# EAGLE design ASM2021 (EAGLE 9.6.2)
DATABASE: ./../../../../../Components/TinyCircuits_Part_Database.txt
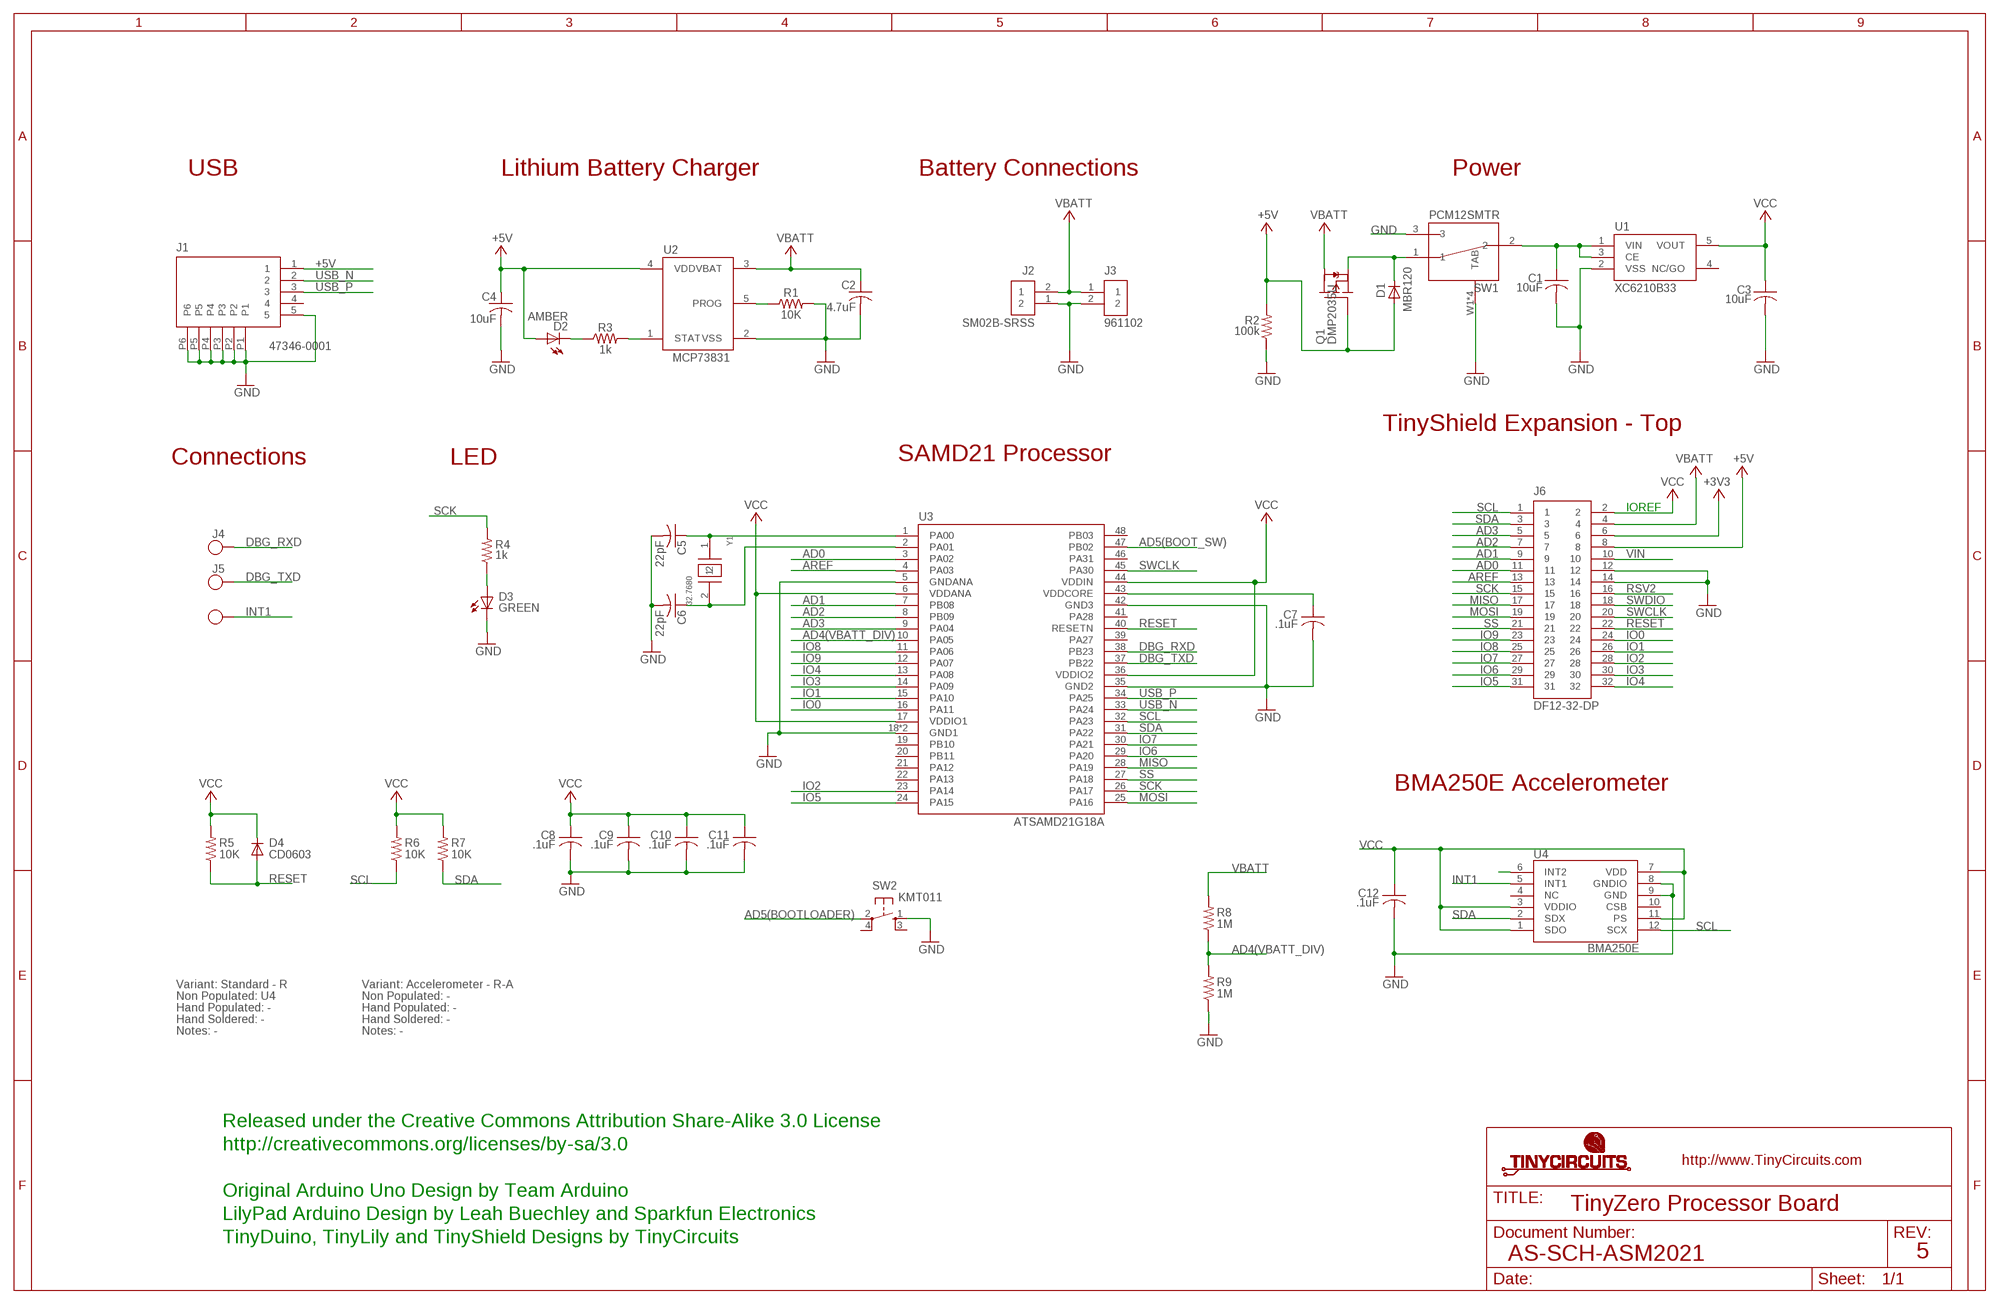
[diagram p0: schematic, sheet 1]

## Parts
C1  10uF  AS-ITM-00002  [C0603]
C2  4.7uF  AS-ITM-00088  [C0603]
C3  10uF  AS-ITM-00002  [C0603]
C4  10uF  AS-ITM-00002  [C0603]
C5  22pF  AS-ITM-00211  [C0402]
C6  22pF  AS-ITM-00211  [C0402]
C7  .1uF  AS-ITM-00008  [C0402]
C8  .1uF  AS-ITM-00008  [C0402]
C9  .1uF  AS-ITM-00008  [C0402]
C10  .1uF  AS-ITM-00008  [C0402]
C11  .1uF  AS-ITM-00008  [C0402]
C12  .1uF  AS-ITM-00008  [C0402]
D1  MBR120  AS-ITM-00111  [SOD-123FL]
D2  AMBER  AS-ITM-00026  [LNJ_LED]
D3  GREEN  AS-ITM-00011  [LNJ_LED]
D4  CD0603  AS-ITM-00009  [0603]
J1  47346-0001  AS-ITM-00021  [MICRO_USB]
J2  SM02B-SRSS  AS-ITM-00231  [JST_SH_2X1]
J3  961102  AS-ITM-00044  [2X.1"]
J4  TEST_POINT  [TEST_POINT_1MM]
J5  TEST_POINT  [TEST_POINT_1MM]
J6  DF12-32-DP  AS-ITM-00015  [DF12-32-DP]
Q1  DMP2035U  AS-ITM-00024  [SOT23]
R1  10K  AS-ITM-00032  [0402]
R2  100k  AS-ITM-00004  [0402]
R3  1k  AS-ITM-00003  [0402]
R4  1k  AS-ITM-00003  [0402]
R5  10K  AS-ITM-00032  [0402]
R6  10K  AS-ITM-00032  [0402]
R7  10K  AS-ITM-00032  [0402]
R8  1M  AS-ITM-00005  [0402]
R9  1M  AS-ITM-00005  [0402]
SW1  PCM12SMTR  AS-ITM-00220  [PCM12SMTR]
SW2  KMT011  AS-ITM-00041  [KMT011]
U1  XC6210B33  AS-ITM-00046  [SOT-25]
U2  MCP73831  AS-ITM-00136  [SOT-23]
U3  ATSAMD21G18A  AS-ITM-00273  [QFN48]
U4  BMA250E  AS-ITM-00070  [3-AXIS_ACCELEROMETER]
Y1  32.7680  AS-ITM-00279  [ABS06]

## Nets
+3V3: J6.6
+5V: C4.1 D1.A D2.A J1.1 J6.8 Q1.B(G) R2.2 U2.4(VDD)
AD0: J6.11 U3.3(PA02)
AD1: J6.9 U3.7(PB08)
AD2: J6.7 U3.8(PB09)
AD3: J6.5 U3.9(PA04)
AD4(VBATT_DIV): R8.1 R9.2 U3.10(PA05)
AD5(BOOT_SW): U3.47(PB02)
AD5(BOOTLOADER): SW2.2
AREF: J6.13 U3.4(PA03)
DBG_RXD: J4.P$1 U3.38(PB23)
DBG_TXD: J5.P$1 U3.37(PB22)
GND: C1.2 C2.2 C3.2 C4.2 C5.2 C6.2 C7.2 C8.2 C9.2 C10.2 C11.2 C12.2 D3.C J1.5 J1.P1 J1.P2 J1.P3 J1.P4 J1.P5 J1.P6 J2.1 J3.2 J6.12 J6.14 R1.2 R2.1 R9.1 SW1.3 SW1.W1(TAB) SW1.W2(TAB) SW1.W3(TAB) SW1.W4(TAB) SW2.1 U1.2(VSS) U2.2(VSS) U3.5(GNDANA) U3.18(GND1) U3.35(GND2) U3.42(GND3) U3.EXP(GND1) U4.8(GNDIO) U4.9(GND)
INT1: U4.5(INT1)
IO0: J6.24 U3.16(PA11)
IO1: J6.26 U3.15(PA10)
IO2: J6.28 U3.23(PA14)
IO3: J6.30 U3.14(PA09)
IO4: J6.32 U3.13(PA08)
IO5: J6.31 U3.24(PA15)
IO6: J6.29 U3.29(PA20)
IO7: J6.27 U3.30(PA21)
IO8: J6.25 U3.11(PA06)
IO9: J6.23 U3.12(PA07)
MISO: J6.17 U3.28(PA19)
MOSI: J6.19 U3.25(PA16)
N$1: C5.1 U3.1(PA00) Y1.1
N$2: D1.C Q1.E(S) SW1.1
N$3: C6.1 U3.2(PA01) Y1.2
N$4: D3.A R4.1
N$5: D2.C R3.1
N$6: R1.1 U2.5(PROG)
N$7: R3.2 U2.1(STAT)
N$8: C7.1 U3.43(VDDCORE)
N$13: U4.6(INT2)
RESET: D4.A J6.22 R5.1 U3.40(RESETN)
RSV2: J6.16
SCK: J6.15 R4.2 U3.26(PA17)
SCL: J6.1 R6.1 U3.32(PA23) U4.12(SCX)
SDA: J6.3 R7.1 U3.31(PA22) U4.2(SDX)
SS: J6.21 U3.27(PA18)
SWCLK: J6.20 U3.45(PA30)
SWDIO: J6.18
USB_N: J1.2 U3.33(PA24)
USB_P: J1.3 U3.34(PA25)
VBATT: C2.1 J2.2 J3.1 J6.4 Q1.C(D) R8.2 U2.3(VBAT)
VCC: C3.1 C8.1 C9.1 C10.1 C11.1 C12.1 D4.C J6.2 R5.2 R6.2 R7.2 U1.5(VOUT) U3.6(VDDANA) U3.17(VDDIO1) U3.36(VDDIO2) U3.44(VDDIN) U4.1(SDO) U4.3(VDDIO) U4.7(VDD) U4.11(PS)
VCC_IN: C1.1 SW1.2 U1.1(VIN) U1.3(CE)
VIN: J6.10
Unconnected: J1.4 SW2.3 SW2.4 U1.4(NC/GO) U3.19(PB10) U3.20(PB11) U3.21(PA12) U3.22(PA13) U3.39(PA27) U3.41(PA28) U3.46(PA31) U3.48(PB03) U4.4(NC) U4.10(CSB)

## Notes on the sheet
- USB | Lithium Battery Charger | Battery Connections | Power
- TinyShield Expansion - Top
- Connections | LED | SAMD21 Processor
- IOREF
- BMA250E Accelerometer
- Variant: Standard - R | Variant: Accelerometer - R-A
- Non Populated: U4 | Non Populated: -
- Hand Populated: - | Hand Populated: -
- Hand Soldered: - | Hand Soldered: -
- Notes: - | Notes: -
- Released under the Creative Commons Attribution Share-Alike 3.0 License
- http://creativecommons.org/licenses/by-sa/3.0
- Original Arduino Uno Design by Team Arduino
- TinyZero Processor Board
- LilyPad Arduino Design by Leah Buechley and Sparkfun Electronics
- TinyDuino, TinyLily and TinyShield Designs by TinyCircuits
- AS-SCH-ASM2021 | 5

## Library data of the parts
C1 C3 C4 = tinycircuits:AS-ITM-00002: CAP CER 10UF 10V 20% X5R 0603; PARTNO: AS-ITM-00002
C2 = tinycircuits:AS-ITM-00088: CAP CER 4.7UF 6.3V 20% X5R 0603; PARTNO: AS-ITM-00088
C5 C6 = tinycircuits:AS-ITM-00211: CAP CER 22PF 50V 2% NP0 0402; PARTNO: AS-ITM-00211
C7-C12 = tinycircuits:AS-ITM-00008: CAP CER 0.1UF 16V 10% X5R 0402; PARTNO: AS-ITM-00008; VALUE: 0.1uF
D1 = tinycircuits:AS-ITM-00111: DIODE SCHOTTKY 20V 1A SOD123L; PARTNO: AS-ITM-00111; PNPROTATION: 0; VALUE: MBR120VLSFT1G
D2 = tinycircuits:AS-ITM-00026: LED AMBER SIDE VIEW SMD; PARTNO: AS-ITM-00026; PNPROTATION: 90
D3 = tinycircuits:AS-ITM-00011: LED GREEN SIDE VIEW SMD; PARTNO: AS-ITM-00011; PNPROTATION: 90
D4 = tinycircuits:AS-ITM-00009: Diodes (General Purpose, Power, Switching) IO=150mA VR=75V HIGH SPEED; PARTNO: AS-ITM-00009; PNPROTATION: 0
J1 = tinycircuits:AS-ITM-00021: CONN RCPT 5POS MICRO USB R/A; PARTNO: AS-ITM-00021; PNPROTATION: 90
J2 = tinycircuits:AS-ITM-00231: CONN HEADER SH 2POS SIDE 1MM; PARTNO: AS-ITM-00231; PNPROTATION: 180; VALUE: SM02B-SRSS-TB(LF)(SN)
J3 = tinycircuits:AS-ITM-00044: CONN HEADER R/A SGL 2POS GOLD; PARTNO: AS-ITM-00044
J4 J5 = tinycircuits:TEST_POINT: Test point, no drill
J6 = tinycircuits:AS-ITM-00015: CONN HEADER 32POS 3MM SMD 0.5MM; PARTNO: AS-ITM-00015; PNPROTATION: 0
Q1 = tinycircuits:AS-ITM-00024: P-Channel MOSFET SOT-23; PARTNO: AS-ITM-00024; PNPROTATION: 0
R1 R5-R7 = tinycircuits:AS-ITM-00032: RES 10.0K OHM 1/16W 1% 0402 SMD; PARTNO: AS-ITM-00032; VALUE: 10.0K
R2 = tinycircuits:AS-ITM-00004: RES 100K OHM 1/16W 1% 0402; PARTNO: AS-ITM-00004; VALUE: 100K
R3 R4 = tinycircuits:AS-ITM-00003: RES 1.00K OHM 1/16W 1% 0402; PARTNO: AS-ITM-00003; VALUE: 1.00K
R8 R9 = tinycircuits:AS-ITM-00005: RES 1.00M OHM 1/16W 1% 0402; PARTNO: AS-ITM-00005; VALUE: 1.00M
SW1 = tinycircuits:AS-ITM-00220: SW SLIDE SP2T 6VDC 0.3A SMT; PARTNO: AS-ITM-00220; PNPROTATION: 0
SW2 = tinycircuits:AS-ITM-00041: SWITCH TACTILE SPST-NO 0.05A 32V; PARTNO: AS-ITM-00041
U1 = tinycircuits:AS-ITM-00046: IC REG LDO 3.3V .7A SOT-25; PARTNO: AS-ITM-00046; PNPROTATION: 270
U2 = tinycircuits:AS-ITM-00136: IC CONTROLLER LI-ION 4.2V SOT23-5; PARTNO: AS-ITM-00136; PNPROTATION: 270
U3 = tinycircuits:AS-ITM-00273: IC MCU 32BIT 256KB FLASH 48QFN; PARTNO: AS-ITM-00273; PNPROTATION: 270
U4 = tinycircuits:AS-ITM-00070: 3-AXIS ACCELEROMOETER; PARTNO: AS-ITM-00070; PNPROTATION: 90; VALUE: BMA250
Y1 = tinycircuits:AS-ITM-00279: Crystal 32.7680kHz 20ppm 12.5pF; PARTNO: AS-ITM-00279

## Board
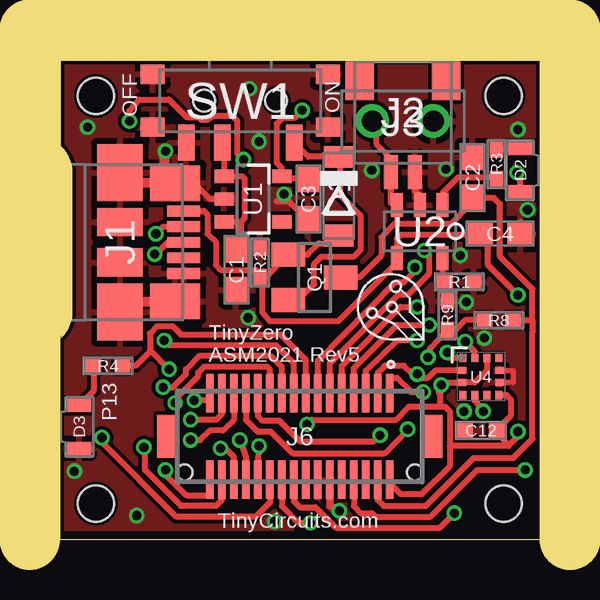
[diagram p1: board, top side]
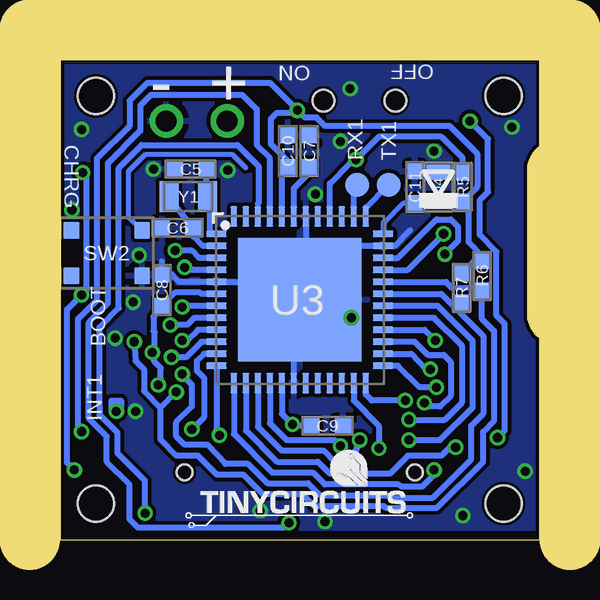
[diagram p2: board, bottom side, seen from below]

Size 20 x 20 mm. Coordinates in mm from the lower left corner, seen from the top.
Outline: 0,20 0,16.4 arc-45 0.5,15.5 0.5,9.3 arc-45 0,8.4 0,0 20,0 20,20 0,20
Copper layers (1*16): Top 0.035mm / dielectric 1.5mm / Bottom 0.035mm
Design rules "default *": minimum track width 8mil, minimum drill 15mil, track to track 6mil, track to pad 6mil, pad to pad 6mil, via to via 6mil, smd to smd 6mil, copper to edge 6mil, drill to drill 8mil, minimum pad ring 8mil, minimum via ring 5mil, stop-mask expansion 4mil, vias tented up to drill 25mil, thermal gap 10mil
Holes 1.5 mm at 1.5,18.5 18.5,18.5 1.5,1.5 18.5,1.5
tRestrict: 2 lines
bRestrict: 2 lines
Milling: 4 lines

### Footprints (pad centres in the part's own frame; a part is rotated, then mirrored left to right if it is on the bottom)
C0603 = smd 1.1 x 1: 1 -0.85,0; 2 0.85,0
C0402 = smd 0.65 x 0.6: 1 -0.65,0; 2 0.65,0
SOD-123FL = smd 0.914 x 1.219: A 1.638,0; C -1.638,0
LNJ_LED = smd 1 x 0.55: A 0,0.9; C 0,-0.9
0603 = smd 0.61 x 0.991: A 0.622,0; C -0.622,0
MICRO_USB = smd 1.38 x 0.45: 1 2.66,1.3; 2 2.66,0.65; 3 2.66,0; 4 2.66,-0.65; 5 2.66,-1.3 | smd 2.1 x 1.475: P1 2.3,-2.462; P2 2.3,2.462 | smd 1.9 x 2.375: P3 0,2.913; P4 0,-2.913 | smd 1.9 x 1.175: P5 0,0.838; P6 0,-0.838
JST_SH_2X1 = smd 0.6 x 1.4: 1 -0.5,2.475; 2 0.5,2.475 | smd 1.2 x 1.6: PAD1 -1.8,-1.325; PAD2 1.8,-1.325
2X.1" = drill 0.889 pad 1.397: 1 -1.27,0; 2 1.27,0
TEST_POINT_1MM = smd 1 x 1: P$1 0,0
DF12-32-DP = smd 0.3 x 1.6: 1 -3.75,-1.8; 2 -3.75,1.8; 3 -3.25,-1.8; 4 -3.25,1.8; 5 -2.75,-1.8; 6 -2.75,1.8; 7 -2.25,-1.8; 8 -2.25,1.8; 9 -1.75,-1.8; 10 -1.75,1.8; 11 -1.25,-1.8; 12 -1.25,1.8; 13 -0.75,-1.8; 14 -0.75,1.8; 15 -0.25,-1.8; 16 -0.25,1.8; 17 0.25,-1.8; 18 0.25,1.8; 19 0.75,-1.8; 20 0.75,1.8; 21 1.25,-1.8; 22 1.25,1.8; 23 1.75,-1.8; 24 1.75,1.8; 25 2.25,-1.8; 26 2.25,1.8; 27 2.75,-1.8; 28 2.75,1.8; 29 3.25,-1.8; 30 3.25,1.8; 31 3.75,-1.8; 32 3.75,1.8 | smd 0.9 x 1.8: F1 -5.5,0; F2 5.5,0 | hole 0.65: -4.8,1.5; 4.8,1.5
SOT23 = smd 1 x 1.4: B -0.95,-1.1; C 0,1.1; E 0.95,-1.1
0402 = smd 0.65 x 0.55: 1 -0.6,0; 2 0.6,0
PCM12SMTR = smd 0.7 x 1.5: 1 -2.25,1.75; 2 0.75,1.75; 3 2.25,1.75 | smd 1 x 0.8: W1 -3.65,1.1; W2 -3.65,-1.1; W3 3.65,-1.1; W4 3.65,1.1 | hole 0.9: 1.5,0; -1.5,0
KMT011 = smd 0.65 x 0.7: 1 -1.475,0.95; 2 -1.475,-0.95; 3 1.475,0.95; 4 1.475,-0.95
SOT-25 = smd 0.55 x 0.8: 1 -0.95,-1.2; 2 0,-1.2; 3 0.95,-1.2; 4 0.95,1.2; 5 -0.95,1.2
SOT-23 = smd 0.5 x 1: 1 -0.95,-1.1; 2 0,-1.1; 3 0.95,-1.1; 4 0.95,1.1; 5 -0.95,1.1
QFN48 = smd 0.85 x 0.28: 1 -3.475,2.75; 2 -3.475,2.25; 3 -3.475,1.75; 4 -3.475,1.25; 5 -3.475,0.75; 6 -3.475,0.25; 7 -3.475,-0.25; 8 -3.475,-0.75; 9 -3.475,-1.25; 10 -3.475,-1.75; 11 -3.475,-2.25; 12 -3.475,-2.75; 25 3.475,-2.75; 26 3.475,-2.25; 27 3.475,-1.75; 28 3.475,-1.25; 29 3.475,-0.75; 30 3.475,-0.25; 31 3.475,0.25; 32 3.475,0.75; 33 3.475,1.25; 34 3.475,1.75; 35 3.475,2.25; 36 3.475,2.75 | smd 0.28 x 0.85: 13 -2.75,-3.475; 14 -2.25,-3.475; 15 -1.75,-3.475; 16 -1.25,-3.475; 17 -0.75,-3.475; 18 -0.25,-3.475; 19 0.25,-3.475; 20 0.75,-3.475; 21 1.25,-3.475; 22 1.75,-3.475; 23 2.25,-3.475; 24 2.75,-3.475; 37 2.75,3.475; 38 2.25,3.475; 39 1.75,3.475; 40 1.25,3.475; 41 0.75,3.475; 42 0.25,3.475; 43 -0.25,3.475; 44 -0.75,3.475; 45 -1.25,3.475; 46 -1.75,3.475; 47 -2.25,3.475; 48 -2.75,3.475 | smd 5.15 x 5.15: EXP 0,0
3-AXIS_ACCELEROMETER = smd 0.3 x 0.35: 1 -0.75,0.775; 4 -0.75,-0.775; 5 -0.25,-0.775; 6 0.25,-0.775; 7 0.75,-0.775; 10 0.75,0.775; 11 0.25,0.775; 12 -0.25,0.775 | smd 0.35 x 0.3: 2 -0.775,0.25; 3 -0.775,-0.25; 8 0.775,-0.25; 9 0.775,0.25
ABS06 = smd 0.8 x 1.3: 1 -0.8,0; 2 0.8,0

### Placement (x,y rotation side)
C1  7.35,11.25 270 top
C2  17.2,15.1 90 top
C3  10.35,14.2 270 top
C4  18.35,12.75 0 top
C5  14.55,15.45 180 bottom
C6  15.1,13 180 bottom
C7  9.6,16.2 90 bottom
C8  15.75,10.4 90 bottom
C9  8.85,4.75 0 bottom
C10  10.5,16.2 90 bottom
C11  5.2,14.7 90 bottom
C12  17.55,4.55 180 top
D1  11.62,14.32 270 top
D2  19.2,15.4 180 top
D3  0.8,4.7 0 top
D4  4.22,14.7 90 bottom
J1  2.5,12.4 0 top
J2  14.3,17.8 180 top
J3  14.3,17.45 0 top
J4  7.6,14.8 0 bottom
J5  6.3,14.8 0 bottom
J6  10,4.3 180 top
Q1  10.61,10.93 270 top
R1  16.65,10.75 0 top
R2  8.34,11.55 270 top
R3  18.2,15.65 270 top
R4  2,7.25 0 top
R5  3.2,14.7 270 bottom
R6  2.4,11 90 bottom
R7  3.25,10.5 90 bottom
R8  18.3,9.15 0 top
R9  16.15,9.35 270 top
SW1  7.52,18.3 180 top
SW2  18.05,11.95 180 bottom
U1  8.05,14.2 270 top
U2  15,12.85 180 top
U3  10,10 0 bottom
U4  17.55,6.8 0 top
U$1  [DOCFIELD-TINYCIRCUITS-PCB]  34,-10 0 top  (outside the outline)
Y1  14.65,14.3 180 bottom

### Tracks (layer width: path | path; a pad name or v marks a point on that pad's centre or on a via)
+5V  (via drill 0.38)
  Top 0.254: J6.8 12.25,1.4 12.55,1.1 13,1.1 13.2,0.95 15.45,0.95 17.4,2.9 v19.4,2.9 | J1.1 6,13.7 6.15,13.55 6.15,12.75 6.5,12.4 6.5,11.45 6.7,11.25 8.15,11.25 8.3,10.92 | 8.44,10.81 8.45,10.77 8.45,9.45 8.75,9.1 11.6,9.1 14.05,11.55 U2.4 14.05,12.55 14.2,12.7 17.1,12.7 C4.1 17.85,13 17.85,11.45 v19.1,10.2 | 8.44,10.81 Q1.B 10.33,11.88 10.8,12.35 11.39,12.35 D1.A | 8.3,10.92 8.44,10.81 | R2.2 8.34,11.01 8.3,10.92 | D2.A 19.2,15.1 v19.05,15.3
  Bottom 0.254: v19.05,15.3 18.9,15.2 18.9,10.4 v19.1,10.2 19.7,9.6 19.7,3.2 v19.4,2.9
AD0  (via drill 0.38)
  Top 0.254: J6.11 11.25,7.35 14.1,10.2 14.5,10.2 15.4,11.1 15.4,11.85 v15.2,12.05
  Bottom 0.254: U3.3 14.2,11.75 14.5,12.05 v15.2,12.05
AD1  (via drill 0.38)
  Top 0.254: J6.9 11.75,7.25 14.2,9.7 v14.9,9.7
  Bottom 0.254: U3.7 14.75,9.75 v14.9,9.7
AD2  (via drill 0.38)
  Top 0.254: J6.7 12.25,7.15 14.05,8.95 v15.4,8.95
  Bottom 0.254: U3.8 14.4,9.25 14.7,8.95 v15.4,8.95
AD3  (via drill 0.38)
  Top 0.254: J6.5 12.75,7.05 14.05,8.3 v14.9,8.3
  Bottom 0.254: U3.9 14.25,8.75 14.7,8.3 v14.9,8.3
AD4(VBATT_DIV)  (via drill 0.38)
  Top 0.254: v15.35,7.6 15.45,8 R9.2 16.5,8.75 16.9,9.15 R8.1
  Bottom 0.254: U3.10 14.1,8.25 14.75,7.6 15.05,7.6 15.25,7.8 v15.35,7.6
AD5(BOOTLOADER)
  Bottom 0.203: 12.25,15.5 12.8,16.05 16.45,16.05 17.15,15.35 17.15,13.48 SW2.2
AREF  (via drill 0.38)
  Top 0.254: J6.13 10.75,7.45 13.98,10.72 14.32,10.72 14.8,11.2 v14.8,11.35
  Bottom 0.254: U3.4 14.6,11.25 v14.8,11.35
DBG_RXD
  Bottom 0.254: U3.38 7.75,14.65 J4.P$1
DBG_TXD
  Bottom 0.254: U3.37 7.25,13.85 J5.P$1
GND  (via drill 0.38)
  Top 0.203: U4.9 18.9,7.05 18.9,6.55 U4.8
  Top 0.254: 11.25,1.4 11.7,1.35 11.5,1.2 | 11.25,2.05 J6.12 | 11.55,1.1 v11.65,1.2 | U1.2 6.25,14.2 5.59,14.86 J1.P2 4.3,14.86 4.35,14.91 | 2.95,14.86 J1.P3 | C3.2 10.3,13.35 9.55,14.1 9.05,14.1 | U2.2 15,14.35 14.8,14.55 J2.1 | 19.7,12.75 19.2,13.25 C4.2
  Top 0.305: 11.25,2.05 11.25,1.4 | v11.65,1.2 11.7,1.35
  Top 0.406: 4.35,16.25 4.35,14.91 | 4.3,14.86 2.95,14.86 | 2.8,9.9 4.8,9.9 J1.P1
  Bottom 0.254: U3.42 9.75,11.1 v7.85,9.25 | v7.85,9.25 U3.EXP | U3.EXP 11.6,10 | U3.18 10.25,9.75 U3.EXP | 5.4,12.9 6.05,12.25 U3.35 7.9,12.25 v7.85,9.25 | 15.75,11.6 C8.2 15.45,11.15 15.05,10.75 U3.5 11.95,10.75
  other vias: 19.1,17.1 3.2,1 0.6,2.85 13,15.4 16.85,5.35 19.5,13.75 16.1,15.45 7.9,18.8 1.15,17.2 4.4,16.2 8.3,16.6 8.95,0.75 9.35,14.4 16.7,11.85 17.7,8.4 16.95,9.9
  pour Top: 0,20 20,20 20,0 0,0
  pour Bottom: 0,20 20,20 20,0 0,0
INT1  (via drill 0.38)
  Top 0.254: U4.5 17.3,5.8 v17.65,5.35
  Bottom 0.254: v17.65,5.35 17.65,5.75 | 17.45,5.55 17.45,5.35 v17.65,5.35 | v17.65,5.35 17.85,5.35 17.85,5.8 17.45,5.8 17.45,5.55 | 17.45,5.55 v17.65,5.35
IO0  (via drill 0.38)
  Top 0.254: v8.3,3.9 8.25,3.4 J6.24
  Bottom 0.254: v8.3,3.9 8.55,4.15 10.55,4.15 11.25,4.85 U3.16
IO1  (via drill 0.38)
  Top 0.254: v7.5,4.15 7.75,3.4 J6.26
  Bottom 0.254: U3.15 11.75,4.7 10.75,3.7 9,3.7 8.55,3.25 8,3.25 7.7,3.55 v7.5,4.15
IO2  (via drill 0.38)
  Top 0.254: J6.28 7.25,3.45 6.9,3.8 v6.7,3.8
  Bottom 0.254: U3.23 7.75,5.8 6.7,4.75 v6.7,3.8
IO3  (via drill 0.38)
  Top 0.254: J6.30 6.75,1.65 6.5,1.4 5.05,1.4 3.55,2.9 3.55,3.8 v3.5,3.85
  Bottom 0.254: U3.14 12.25,4.55 10.95,3.25 9.25,3.25 8.75,2.75 6.25,2.75 5.5,3.5 4.1,3.5 3.75,3.85 v3.5,3.85
IO4  (via drill 0.38)
  Top 0.254: J6.32 6.25,1.95 6.15,1.85 5.25,1.85 4.4,2.7 v4.4,2.9
  Bottom 0.254: U3.13 12.75,4.4 11.15,2.8 9.45,2.8 8.95,2.3 5.9,2.3 5.75,2.2 4.9,2.2 4.4,2.7 v4.4,2.9
IO5  (via drill 0.38)
  Top 0.254: J6.31 6.25,5.8 v5.6,5.8
  Bottom 0.254: v5.6,5.8 7,5.8 7.25,6.05 U3.24
IO6  (via drill 0.38)
  Top 0.254: J6.29 6.75,5.25 6.5,5 v5.45,5
  Bottom 0.254: U3.29 4.4,9.25 3.25,8.1 3.25,5.7 3.95,5 v5.45,5
IO7  (via drill 0.38)
  Top 0.254: J6.27 7.25,5 6.8,4.55 6.25,4.55 5.85,4.15 v5.45,4.15
  Bottom 0.254: U3.30 4.25,9.75 2.8,8.3 2.8,5.5 4.15,4.15 v5.45,4.15
IO8  (via drill 0.38)
  Top 0.254: J6.25 7.75,5 8.25,4.5 8.8,4.5 9.7,3.6 13.55,3.6 v14.5,4.6
  Bottom 0.254: U3.11 14,7.75 14.3,7.45 14.3,7.05 14,6.75 14,5.1 v14.5,4.6 14.3,4.8
IO9  (via drill 0.38)
  Top 0.254: J6.23 8.25,5.15 8.45,4.95 9.15,4.95 10,4.1 13.1,4.1 v13.35,4.35
  Bottom 0.254: U3.12 13.48,4.47 v13.35,4.35
MISO  (via drill 0.38)
  Top 0.254: J6.17 9.75,7.35 9,8.1 4.55,8.1 v4.35,8.3
  Bottom 0.254: U3.28 4.8,8.75 v4.35,8.3
MOSI  (via drill 0.38)
  Top 0.254: J6.19 9.25,7.2 8.8,7.65 5.8,7.65 5.25,7.1 5.25,6.9 4.7,6.35 v4.3,6.35
  Bottom 0.254: 6.5,7.23 U3.25 5.9,7.25 5,6.35 v4.3,6.35
N$1
  Bottom 0.254: C5.1 13.9,14.65 | 13.9,14.65 Y1.1 | U3.1 13.75,12.75 13.75,14.2 13.9,14.65
N$2
  Top 0.254: Q1.E 9.93,9.98 10.6,10.65 10.6,11.5 10.9,11.8 12.25,11.8 12.55,12.1 12.55,13.5 11.7,14.35 11.7,16.08 D1.C | 11.85,15.88 D1.C | D1.C 10.36,15.96 SW1.1
N$3
  Bottom 0.254: U3.2 14.05,12.25 14.45,12.65 C6.1 15.1,13.8 Y1.2
N$4
  Top 0.254: R4.1 1.4,6.2 D3.A
N$5
  Top 0.254: R3.1 18.2,16.3 D2.C
N$6
  Top 0.254: U2.5 15.95,10.7 R1.1
N$7
  Top 0.254: R3.2 18.2,15.15 18.15,15 18,15.1 16.6,15.1 15.95,14.45 U2.1
N$8
  Bottom 0.254: U3.43 10.25,14.65 9.5,15.4 C7.1 9.55,15.45
RESET  (via drill 0.38)
  Top 0.254: J6.22 8.75,1.55 8.15,0.95 4.85,0.95 1.75,4.05 v1.75,4.25 | v2.9,17.45 2.9,17.9 3.3,18.35 4.55,18.35 5.3,17.6 5.75,17.6 5.9,17.5 6.15,17.5 6.4,17.65 7.2,17.65 7.4,17.45 7.4,16.1 v7.65,15.85
  Bottom 0.254: U3.40 8.75,14.85 7.9,15.7 7.8,15.7 v7.65,15.85 6.7,16.8 4.1,16.8 3.2,15.9 R5.1 4.2,15.3 D4.A | v1.75,4.25 1.45,4.55 1.45,9 1.8,9.35 1.8,12 2.5,12.7 2.5,14.15 2.15,14.5 2.15,16.7 v2.9,17.45
SCK  (via drill 0.38)
  Top 0.254: J6.15 10.25,7.5 9.2,8.55 5.05,8.55 4.7,8.9 4.05,8.9 3.75,8.6 3.75,7.9 | R4.2 3.15,7.25 3.75,7.85 3.75,7.9 | 3.75,7.9 v4.55,7.1
  Bottom 0.254: U3.26 5.35,7.75 4.75,7.1 v4.55,7.1
SCL  (via drill 0.38)
  Top 0.254: J6.1 13.75,6.75 14.05,6.75 14.65,6.15 v15.15,6.15 | U4.12 17.3,7.85 17.05,8.1 16.95,8.1 16.9,8.15 v16.9,8.25 16.9,8.35
  Bottom 0.203: 3.65,10.5 2.6,10.5 2.5,10.4 R6.1
  Bottom 0.254: U3.32 3.9,10.75 3.65,10.5 | 15.8,5.5 15.8,4.15 15.15,3.5 14.25,3.5 13.45,2.7 12.35,2.7 11.55,1.9 9.9,1.9 9.4,1.4 6.5,1.4 6.43,1.32 4.28,1.32 2.35,3.25 2.35,4.5 1.9,4.95 1.9,8.7 2.4,9.2 R6.1 | 15.8,5.5 v15.15,6.15 15.15,6.25 | v16.9,8.25 16.85,7.45 16.5,7.1 16.5,6.2 15.8,5.5
SDA  (via drill 0.38)
  Top 0.254: J6.3 13.25,6.95 13.55,7.25 14.35,7.25 14.7,6.9 v14.9,6.9 15.05,6.75 15.35,6.75 15.65,7.05 U4.2
  Bottom 0.254: U3.31 4.1,10.25 3.53,9.68 | 3.53,9.68 2.35,8.5 2.35,5.25 2.85,4.75 2.85,3.35 4.45,1.75 6.05,1.75 6.15,1.85 9.15,1.85 9.65,2.35 11.35,2.35 12.15,3.15 13.1,3.15 13.85,3.95 14.8,3.95 15.15,4.3 15.15,4.9 14.5,5.55 14.5,6.45 14.95,6.9 v14.9,6.9 | R7.1 3.47,9.68 3.53,9.68
SS  (via drill 0.38)
  Top 0.254: J6.21 8.75,7.1 8.65,7.2 6,7.2 5.75,6.95 5.75,6.8 4.8,5.85 v4.8,5.7
  Bottom 0.254: U3.27 5.2,8.25 4.65,7.7 4,7.7 3.7,7.4 3.7,6 4.15,5.55 4.65,5.55 v4.8,5.7
SWCLK  (via drill 0.38)
  Top 0.254: J6.20 9.25,1.4 9.95,0.7 v10.45,0.7
  Bottom 0.254: U3.45 11.25,15.9 11.8,16.45 11.8,17.95 12.4,18.55 16.2,18.55 16.65,18.1 16.65,17.05 18,15.7 18,9.85 18.8,9.05 18.8,5.05 18.05,4.3 18.05,3.25 17.1,2.3 17.1,0.85 16.75,0.5 10.65,0.5 v10.45,0.7
SWDIO  (via drill 0.38)
  Top 0.254: J6.18 9.75,1.6 10,1.35 10.65,1.35 11.5,0.5 15.85,0.5 v16.45,1.1
  Bottom 0.254: v16.45,1.1 16.45,2.45 17.6,3.6 17.6,4.45 18.35,5.2 18.35,5.55 18.35,8.85 17.55,9.65 17.55,15.5 16.6,16.45 12.6,16.45 11.7,15.55 11.7,14.05 11.75,14
USB_N  (via drill 0.38)
  Top 0.254: v4,12.75 4.3,13.05 J1.2
  Bottom 0.254: U3.33 5.5,11.25 v4,12.75
USB_P  (via drill 0.38)
  Top 0.254: v3.95,11.9 4,11.9 4.5,12.4 J1.3
  Bottom 0.254: U3.34 5.9,11.75 4.3,13.35 3.7,13.35 3.4,13.05 3.4,12.45 v3.95,11.9
VBATT
  Top 0.254: J6.4 13.25,1.65 13.5,1.4 15.25,1.4 17.25,3.4 18.9,3.4 19.7,4.2 19.7,8.65 19.7,9.15 | 13.95,13.15 14.05,13.25 U2.3 13.8,14.05 J2.2 13.8,15.9 13.2,16.5 13.2,17.28 J3.1 | 12.08,11.3 Q1.C 12.48,10.93 13.4,11.85 13.4,12.6 13.95,13.15 | 13.95,13.15 16.3,13.15 16.55,13.4 17.1,14 C2.1 17.25,14.6 17.6,14.25 18.1,14.25 18.35,14 18.35,11.8 19.7,10.45 19.7,9.15 | R8.2 19.7,9.15
VCC  (via drill 0.38)
  Top 0.254: v10.3,4.8 10.5,5 14,5 14.55,5.55 15.85,5.55 | J6.2 13.75,2.35 14.2,1.9 15.1,1.9 16.25,3.05 16.25,3.9 | 16.25,3.9 16.25,5.35 16.05,5.55 15.85,5.55 | C3.1 9.35,15.05 U1.5 9.25,15.5 9.05,15.7 9.05,17.35 9.3,17.6 9.8,17.6 v10.1,17.9 | U4.11 17.8,7.05 17.3,6.55 U4.3 16.2,6.55 15.8,6.15 v15.9,6.45 15.85,6 15.85,5.55 | U4.7 18.62,6.02 18.8,5.85 18.8,5.15 C12.1 18.7,3.9 | 18.7,3.9 16.25,3.9 | v19.1,4.5 19.1,4.3 18.7,3.9 | U4.1 16.18,7.57 v16.15,7.8
  Bottom 0.203: 6.5,13.2 5.65,14.05 C11.1
  Bottom 0.254: U3.17 10.75,5.25 v10.3,4.8 10.25,4.75 C9.1 | U3.44 10.75,15.3 10.6,15.4 C10.1 10.4,15.7 11.2,16.5 11.2,17.55 10.95,17.8 10.2,17.8 v10.1,17.9 | U3.36 6.5,12.77 6.5,13.2 | C11.1 4.25,14.05 | 4.25,14.05 3.2,14.05 | 3.2,14.05 2.95,14.05 | 2.95,14.05 2.95,14.2 | 2.95,14.05 2.95,12.4 2.4,11.85 R6.2 2.75,11.6 R7.2 | D4.C 4.25,14.05 | 3.2,14.05 R5.2 2.6,14.7 2.6,16.1 3.75,17.25 8.95,17.25 9.3,17.6 9.8,17.6 v10.1,17.9 | v10.1,17.9 11.25,19.05 16.35,19.05 17.1,18.3 17.1,17.25 18.45,15.9 18.45,10 19.25,9.2 19.25,4.65 v19.1,4.5 | U3.6 14.1,10.25 14.15,10.3 15.2,10.3 C8.1 16.1,9.3 16.1,8.7 16.05,8.65 16.05,7.9 v16.15,7.8 16.05,7.4 15.8,7.15 15.8,6.7 16,6.4 v15.9,6.45
VCC_IN
  Top 0.254: SW1.2 6.85,16.47 U1.1 7.6,15.15 7.7,15.05 7.7,13.4 7.55,13.25 | 7.55,13.25 U1.3 | 7.55,13.25 7.55,12.3 C1.1

### Text on the board
tPlace: OFF | ON | TinyZero | ASM2021 Rev5 | P13 | TinyCircuits.com
bPlace: OFF | ON | + | - | TX1 | RX1 | CHRG | BOOT | INT1
tRestrict: ^ V-SCORE EDGE ALONG OUTLINE ^
Document: FABRICATION DRAWING | NOTES: | 1. PRINTED CIRCUIT BOARD MADE FROM NEMA GRADE FR-4 EPOXY LAMINATE | WITH 1 OUNCE COPPER PLATING AND .024 THICKNESS. | 2. ALL DIMENSIONS ARE GIVEN IN INCHES. | 3. CIRCUIT PATHS ARE FOR REFERENCE ONLY. | 4. HOLE SIZES SHOWN ARE FINISHED DIAMETERS AFTER PLATING. | 5. BOARD PLATED USING REFLOW OR SIMILAR METHOD. | 6. BOARD TO HAVE BLUE SOLDER MASK ON PLATED SURFACES USING WET FILM | 7. SILKSCREEN BOARD USING WHITE INK. | SR100 OR SR1010 EPOXY. EQUIVALENT WET OR DRY FILM MAY BE USED. | 8. THE FOLLOWING INFORMATION APPLIES TO THIS BOARD: | * 2 COPPER LAYERS | * .024 BOARD THICKNESS | * REQUIRES TOP SIDE SILKSCREEN | Released under the Creative Commons Attribution Share-Alike 3.0 License | http://creativecommons.org/licenses/by-sa/3.0 | LilyPad Arduino Design by Leah Buechley and Sparkfun Electronics | Original Arduino Uno Design by Team Arduino | TinyDuino, TinyLily and TinyShield Designs by TinyCircuits | TinyZero Processor Board | AS-PCB-ASM2021 | 5